# EAGLE design PowerBoard (EAGLE 6.5.0)
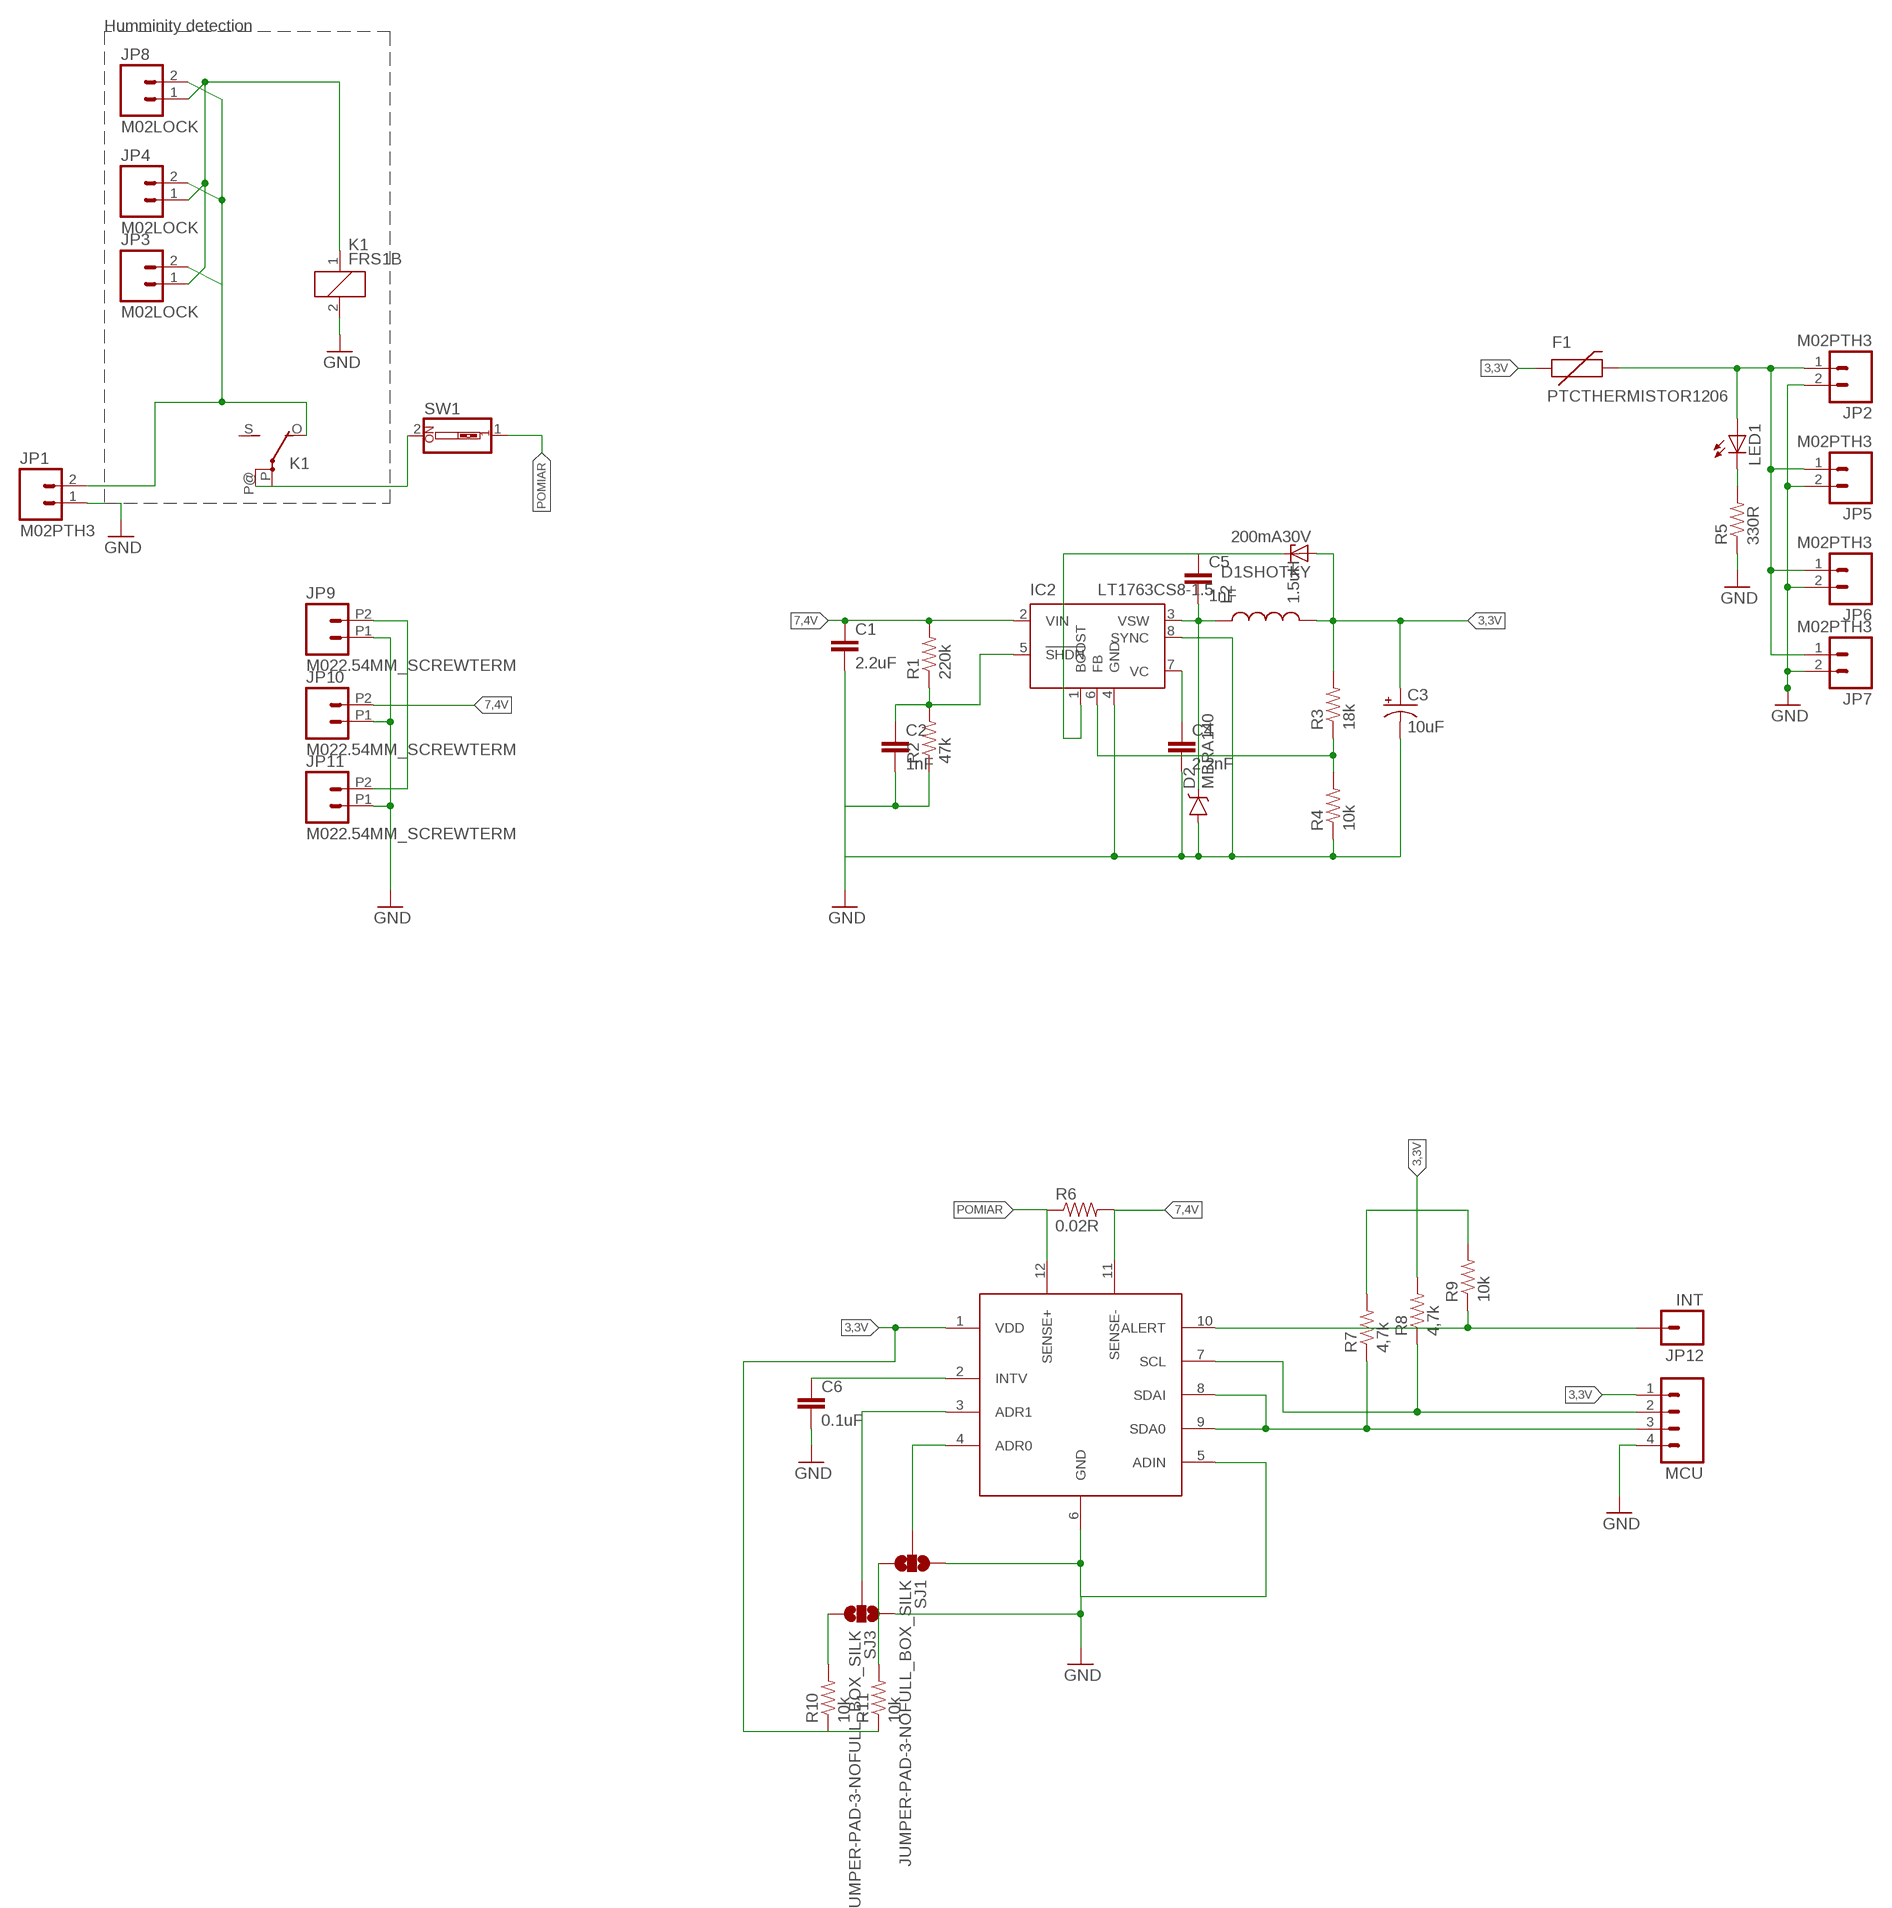
[diagram p0: schematic, sheet 1]

## Parts
C1  2.2uF  CAP0805  [0805]
C2  1nF  CAP0805  [0805]
C3  10uF  CAP_POLC  [PANASONIC_C]
C4  2.2nF  CAP0805  [0805]
C5  1nF  CAP0805  [0805]
C6  0.1uF  CAP0805  [0805]
D1SHOTKY  200mA30V  ZENER-DIODESOD80C  [SOD80C]
D2  MBRA140  [SMA-DIODE]
F1  PTCTHERMISTOR1206  [PTC-1206]
IC2  LT1763CS8-1.5  [SOIC8]
JP1  M02PTH3  [1X02_LONGPADS]
JP2  M02PTH3  [1X02_LONGPADS]
JP3  M02LOCK  [1X02_LOCK]
JP4  M02LOCK  [1X02_LOCK]
JP5  M02PTH3  [1X02_LONGPADS]
JP6  M02PTH3  [1X02_LONGPADS]
JP7  M02PTH3  [1X02_LONGPADS]
JP8  M02LOCK  [1X02_LOCK]
JP9  M022.54MM_SCREWTERM  [1X02_2.54_SCREWTERM]
JP10  M022.54MM_SCREWTERM  [1X02_2.54_SCREWTERM]
JP11  M022.54MM_SCREWTERM  [1X02_2.54_SCREWTERM]
JP12  INT  M01PTH_LONGPAD  [1X01_LONGPAD]
K1  FRS1B  [FRS1B]
L2  1.5uH  INDUCTOR-B82462G  [B82462G]
LED1  LEDSML0805  [SML0805]
MCU  M04POLAR_LOCK  [MOLEX-1X4_LOCK]
R1  220k  RESISTOR0805-RES  [0805]
R2  47k  RESISTOR0805-RES  [0805]
R3  18k  RESISTOR0805-RES  [0805]
R4  10k  RESISTOR0805-RES  [0805]
R5  330R  RESISTOR0805-RES  [0805]
R6  0.02R  RESISTOR2512  [R2512]
R7  4,7k  RESISTOR0805-RES  [0805]
R8  4,7k  RESISTOR0805-RES  [0805]
R9  10k  RESISTOR0805-RES  [0805]
R10  10k  RESISTOR0805-RES  [0805]
R11  10k  RESISTOR0805-RES  [0805]
SJ1  JUMPER-PAD-3-NOFULL_BOX_SILK  [PAD-JUMPER-3-NO_YES_SILK_FULL_BOX]
SJ3  JUMPER-PAD-3-NOFULL_BOX_SILK  [PAD-JUMPER-3-NO_YES_SILK_FULL_BOX]
SW1  SW_DIP-1  [EDG-01]
U$1  LTC2945  [SOP65P490X110-12N]

## Nets
3,3V: C3.+ D1SHOTKY.A F1.1 L2.P$2 MCU.1 R3.2 R7.2 R8.2 R9.2 R10.1 R11.1 U$1.1(VDD)
7,4V: C1.1 IC2.2(VIN) JP9.P2 JP10.P2 JP11.P2 R1.2 R6.2 U$1.11(SENSE-)
AFERFUSE: F1.2 JP2.1 JP5.1 JP6.1 JP7.1 LED1.A
COIL: JP3.1 JP4.1 JP8.1 K1.1
COUT: C5.2 D2.C IC2.3(VSW) L2.P$1
GND: C1.2 C2.2 C3.- C4.2 C6.2 D2.A IC2.4(GND) IC2.8(SYNC) JP1.1 JP2.2 JP5.2 JP6.2 JP7.2 JP9.P1 JP10.P1 JP11.P1 K1.2 MCU.4 R2.1 R4.1 R5.1 SJ1.1 SJ3.1 U$1.5(ADIN) U$1.6(GND)
N$1: C2.1 IC2.5(!SHDN) R1.1 R2.2
N$3: IC2.6(FB) R3.1 R4.2
N$4: C4.1 IC2.7(VC)
N$5: C5.1 D1SHOTKY.C IC2.1(BOOST)
N$7: LED1.C R5.2
N$9: JP12.1 R9.1 U$1.10(ALERT)
N$10: MCU.2 R8.1 U$1.7(SCL)
N$11: MCU.3 R7.1 U$1.8(SDAI) U$1.9(SDA0)
N$12: C6.1 U$1.2(INTV)
N$13: SJ3.2 U$1.3(ADR1)
N$14: SJ1.2 U$1.4(ADR0)
N$15: R10.2 SJ3.3
N$16: R11.2 SJ1.3
POMIAR: R6.1 SW1.1 U$1.12(SENSE+)
PRERELAY: JP1.2 JP3.2 JP4.2 JP8.2 K1.O(2:O)
PRESWITCH: K1.P(2:P) K1.P@(2:P) SW1.2
Unconnected: K1.S(2:S)

## Notes on the sheet
- Humminity detection

## Library data of the parts
C1 C2 C4-C6 = SparkFun-Capacitors:CAP: Capacitor Standard 0603 ceramic capacitor, and 0.1" leaded capacitor.
C3 = SparkFun-Passives:CAP_POL: Capacitor Polarized These are standard SMD and PTH capacitors. Normally 10uF, 47uF, and 100uF in electrolytic and tantalum varieties. Always verify the external diameter of the through hole cap, it varies with capacity, voltage, and manufacturer. The EIA devices should be standard.
D1SHOTKY = diode:ZENER-DIODE: Z-Diode
D2 = SparkFun-DiscreteSemi:MBRA140: 40V, 1A Schottky rectifier SMA/DO-214AC package DIO-08053; PROD_ID: DIO-08053
F1 = SparkFun-PowerIC:PTC: Resettable Fuse PTC Resettable Fuse. Spark Fun Electronics SKU : COM-08357; PROD_ID: RES-08585
IC2 = linear-technology:LT1763CS8: 500mA, Low Noise, LDO Micropower Regulators Source: http://cds.linear.com/docs/Datasheet/1763ff.pdf; MPN: LT1763CS8-1.5; OC_FARNELL: 1501016; OC_NEWARK: 57M6043
JP1-JP11 = SparkFun-Connectors:M02: Standard 2-pin 0.1" header. Use with - straight break away headers ( PRT-00116) - right angle break away headers (PRT-00553) - swiss pins (PRT-00743) - machine pins (PRT-00117) - female headers (PRT-00115) Molex polarized connector foot print use with: PRT-08233 with associated crimp pins and housings. 2.54_SCREWTERM for use with PRT-10571. 3.5mm Screw Terminal footprints for PRT-08084 5mm Screw Terminal footprints for use with PRT-08432
JP12 = SparkFun-Connectors:M01: Header 1 Standard 1-pin 0.1" header. Use with straight break away headers (SKU : PRT-00116), right angle break away headers (PRT-00553), swiss pins (PRT-00743), machine pins (PRT-00117), and female headers (PRT-00115).
K1 = relay:FRS1B: RELAY 1 x switch, same as V23101-D6-A201, Siemens; OC_FARNELL: unknown; OC_NEWARK: unknown
L2 = SparkFun-Passives:INDUCTOR: Inductors Basic Inductor/Choke - 0603 and 1206. Footprints are not proven and vary greatly between part numbers. SRN6045- 33uH, 20% 1.4A SDR0403-560KL - 56uH, 10%, 500mA RMS/740mA peak
LED1 = led:LED: LED OSRAM: - CHIPLED LG R971, LG N971, LY N971, LG Q971, LY Q971, LO R971, LY R971 LH N974, LH R974 LS Q976, LO Q976, LY Q976 LO Q996 - Hyper CHIPLED LW Q18S LB Q993, LB Q99A, LB R99A - SideLED LS A670, LO A670, LY A670, LG A670, LP A670 LB A673, LV A673, LT A673, LW A673 LH A674 LY A675 LS A676, LA A676, LO A676, LY A676, LW A676 LS A679, LY A679, LG A679 - Hyper Micro SIDELED® LS Y876, LA Y876, LO Y876, LY Y876 LT Y87S - SmartLED LW L88C, LW L88S LB L89C, LB L89S, LG L890 LS L89K, LO L89K, LY L89K LS L896, LA L896, LO L896, LY L896 - TOPLED LS T670, LO T670, LY T670, LG T670, LP T670 LSG T670, LSP T670, LSY T670, LOP T670, LYG T670 LG T671, LOG T671, LSG T671 LB T673, LV T673, LT T673, LW T673 LH T674 LS T676, LA T676, LO T676, LY T676, LB T676, LH T676, LSB T676, LW T676 LB T67C, LV T67C, LT T67C, LS T67K, LO T67K, LY T67K, LW E67C LS E67B, LA E67B, LO E67B, LY E67B, LB E67C, LV E67C, LT E67C LW T67C LS T679, LY T679, LG T679 LS T770, LO T770, LY T770, LG T770, LP T770 LB T773, LV T773, LT T773, LW T773 LH T774 LS E675, LA E675, LY E675, LS T675 LS T776, LA T776, LO T776, LY T776, LB T776 LHGB T686 LT T68C, LB T68C - Hyper Mini TOPLED® LB M676 - Mini TOPLED Santana® LG M470 LS M47K, LO M47K, LY M47K Source: http://www.osram.convergy.de LUXEON: - LUMILED® LXK2-PW12-R00, LXK2-PW12-S00, LXK2-PW14-U00, LXK2-PW14-V00 LXK2-PM12-R00, LXK2-PM12-S00, LXK2-PM14-U00 LXK2-PE12-Q00, LXK2-PE12-R00, LXK2-PE12-S00, LXK2-PE14-T00, LXK2-PE14-U00 LXK2-PB12-K00, LXK2-PB12-L00, LXK2-PB12-M00, LXK2-PB14-N00, LXK2-PB14-P00, LXK2-PB14-Q00 LXK2-PR12-L00, LXK2-PR12-M00, LXK2-PR14-Q00, LXK2-PR14-R00 LXK2-PD12-Q00, LXK2-PD12-R00, LXK2-PD12-S00 LXK2-PH12-R00, LXK2-PH12-S00 LXK2-PL12-P00, LXK2-PL12-Q00, LXK2-PL12-R00 Source: www.luxeon.com KINGBRIGHT: KA-3528ASYC Source: www.kingbright.com
MCU = SparkFun-Connectors:M04: Header 4 Standard 4-pin 0.1" header. Use with straight break away headers (SKU : PRT-00116), right angle break away headers (PRT-00553), swiss pins (PRT-00743), machine pins (PRT-00117), and female headers (PRT-00115). Molex polarized connector foot print use with SKU : PRT-08231 with associated crimp pins and housings. 1MM SMD Version SKU: PRT-10208
R1-R5 R7-R11 = SparkFun-Resistors:RESISTOR: Resistor Basic schematic elements and footprints for 0603, 1206, and PTH resistors.
R6 = SparkFun-Passives:RESISTOR: Resistor Basic schematic elements and footprints for 0603, 1206, and PTH resistors.
SJ1 SJ3 = SparkFun-Passives:JUMPER-PAD-3-NO
SW1 = special:SW_DIP-1: DIP SWITCH
U$1 = LTC_By_element14_Batch_1:LTC2945

## Board
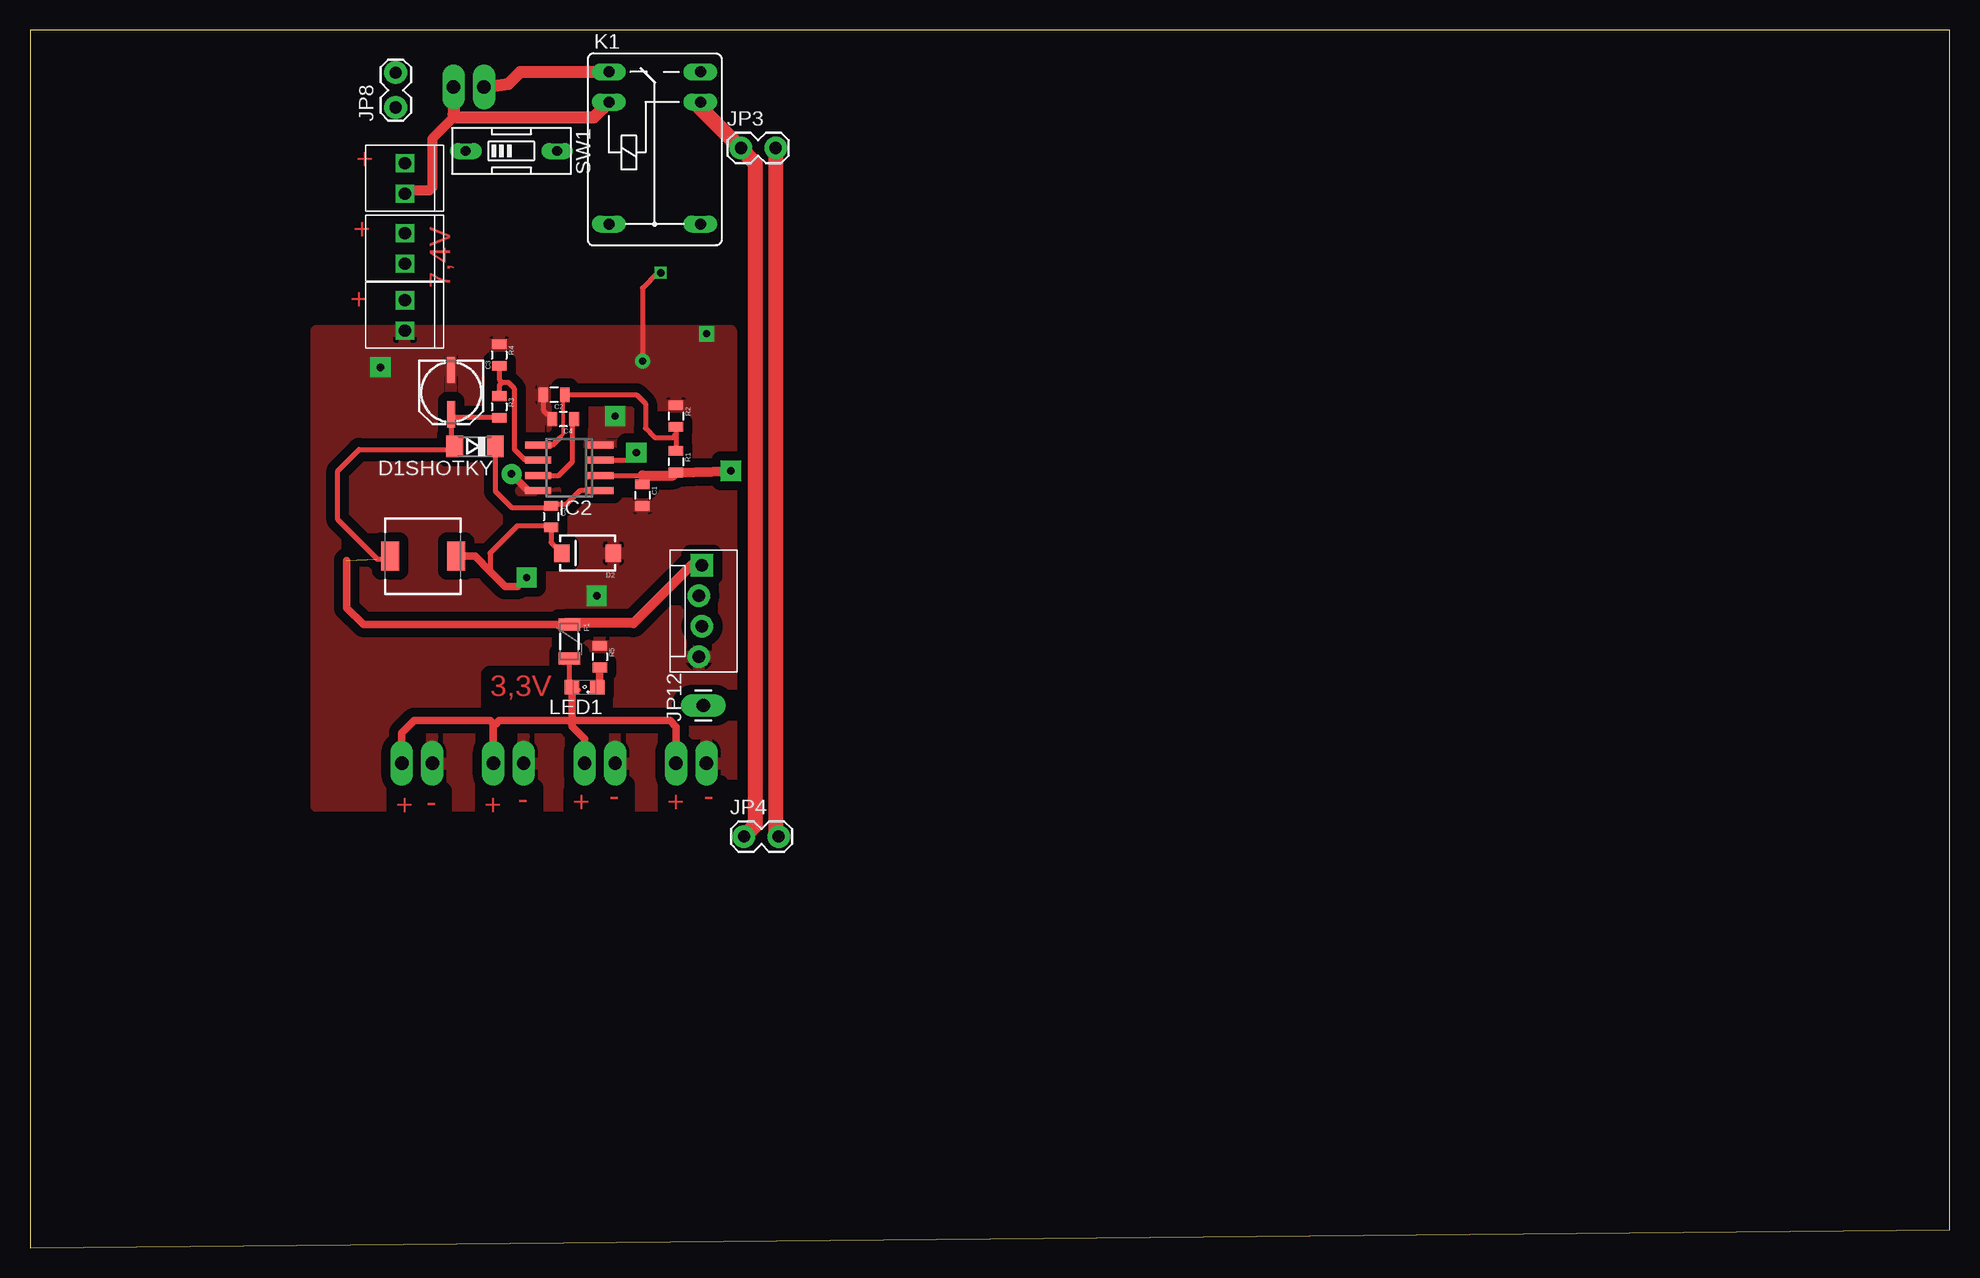
[diagram p1: board, top side]
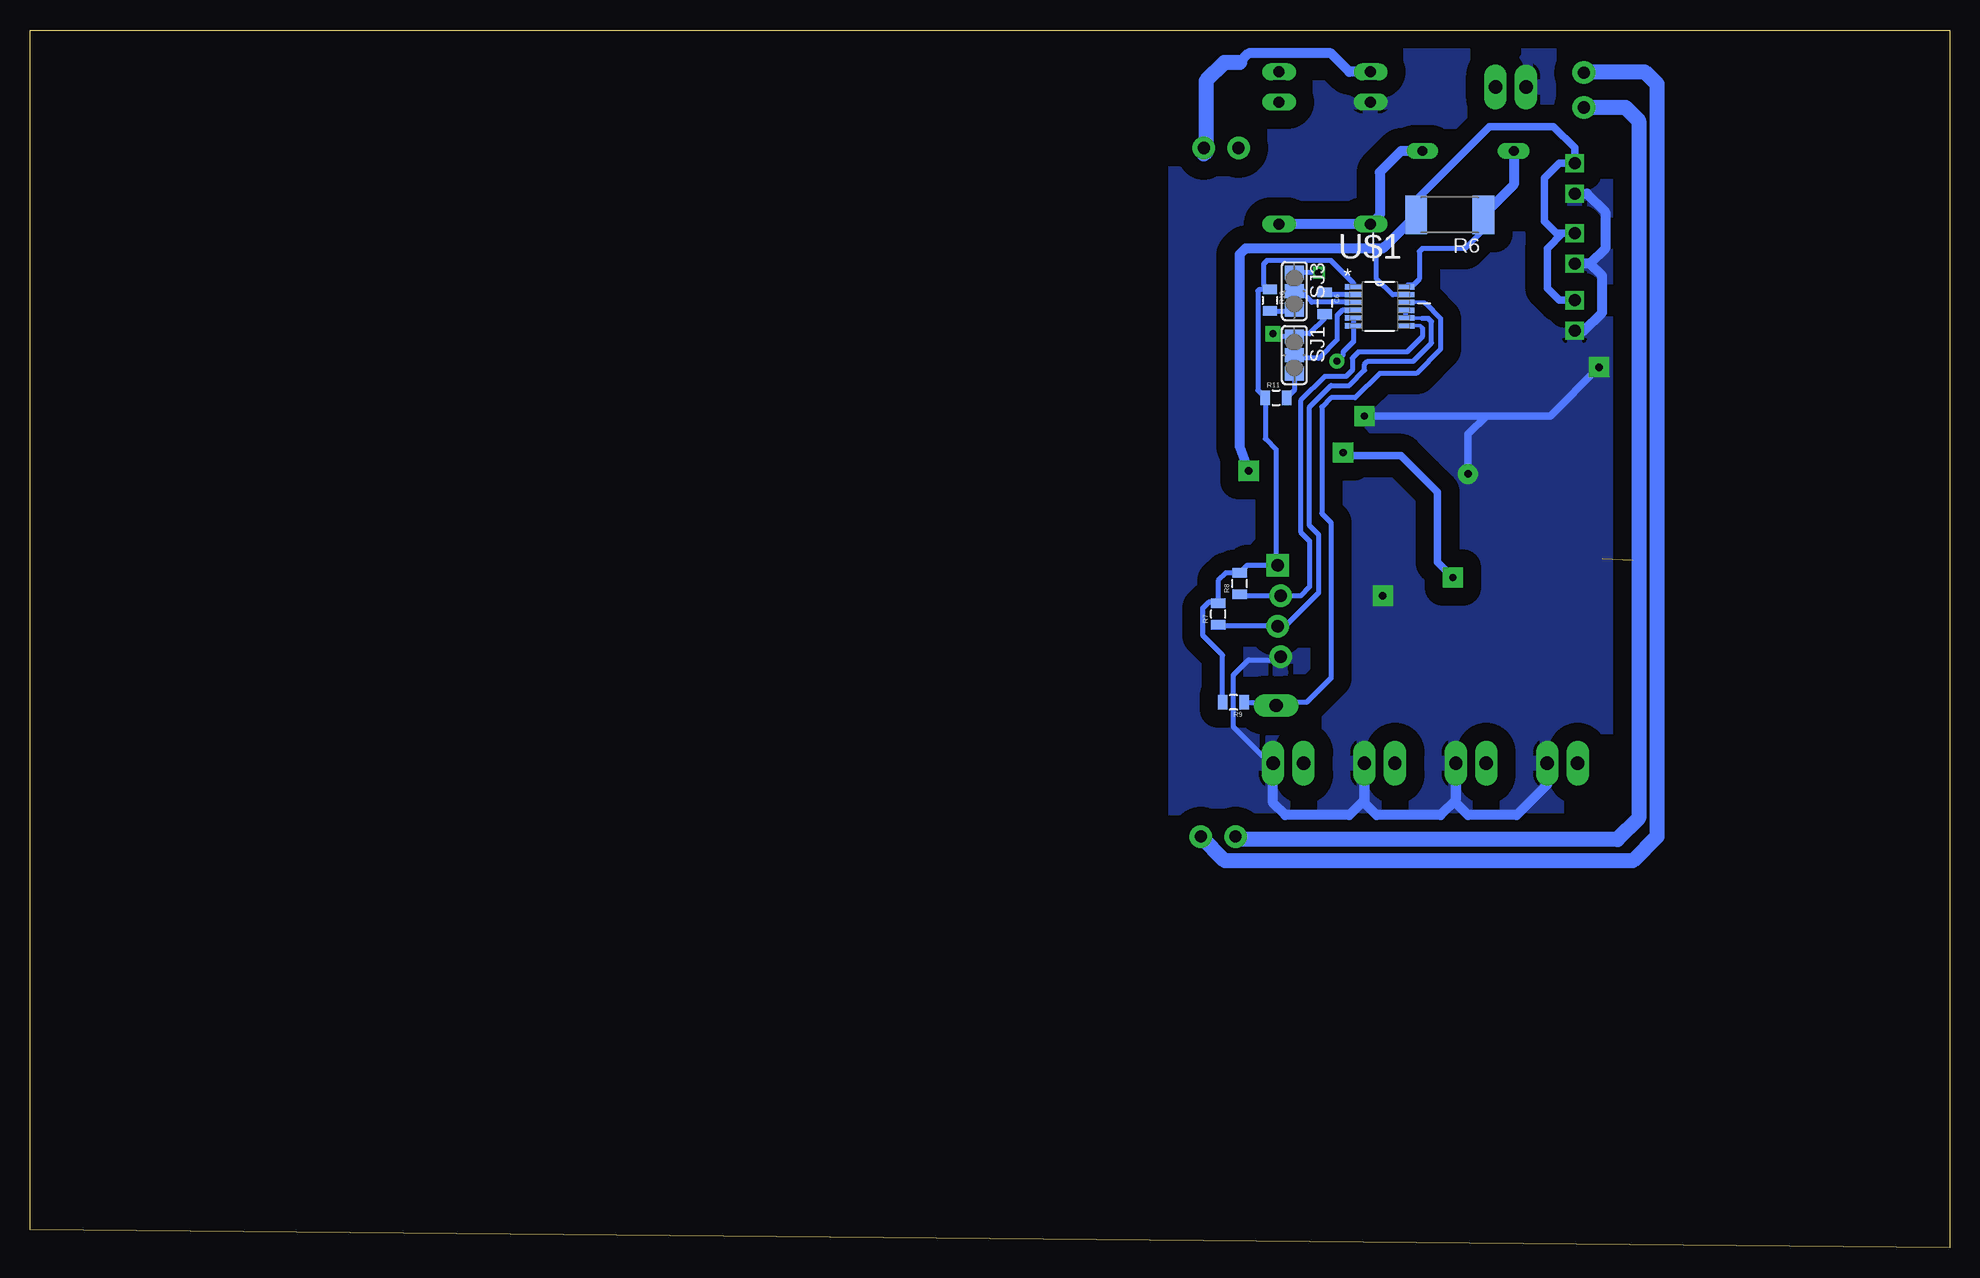
[diagram p2: board, bottom side, seen from below]

Size 160 x 101.52 mm. Coordinates in mm from the lower left corner, seen from the top.
Outline: 0,0 160,1.52 160,101.52 0,101.52 0,0
Copper layers (1*16): Top 0.035mm / dielectric 1.5mm / Bottom 0.035mm
Design rules "default": minimum track width 10mil, minimum drill 24mil, track to track 8mil, track to pad 8mil, pad to pad 8mil, via to via 8mil, smd to smd 8mil, copper to edge 40mil, drill to drill 8mil, minimum pad ring 10mil, minimum via ring 8mil, stop-mask expansion 4mil, vias tented up to drill 0mil, thermal gap 10mil

### Footprints (pad centres in the part's own frame; a part is rotated, then mirrored left to right if it is on the bottom)
0805 = smd 0.8 x 1.2: 1 -0.9,0; 2 0.9,0
PANASONIC_C = smd 2.2 x 0.65: + 1.9,-0.2; - -1.8,-0.2
SOD80C = smd 1.4 x 1.8: A 1.7,0; C -1.7,0
SMA-DIODE = smd 1.27 x 1.47: A -2.15,0; C 2.15,0
PTC-1206 = smd 1 x 1.8: 1 -1.4,0; 2 1.4,0
SOIC8 = smd 0.6 x 2.2: 1 -1.905,-2.6; 2 -0.635,-2.6; 3 0.635,-2.6; 4 1.905,-2.6; 5 1.905,2.6; 6 0.635,2.6; 7 -0.635,2.6; 8 -1.905,2.6
1X02_LONGPADS = drill 1.118 pad 1.88 long: 1 0,0; 2 2.54,0
1X02_LOCK = drill 1.016 pad 1.88: 1 -0.178,0; 2 2.718,0
1X02_2.54_SCREWTERM = drill 1.016 square: P1 2.54,0; P2 0,0
1X01_LONGPAD = drill 1.118 pad 1.88 long: 1 0,0
FRS1B = drill 0.914 long: 1 0,3.81; 2 0,-3.81; O -2.54,-3.81; P 10.16,3.81; P@ 10.16,-3.81; S -2.54,3.81
B82462G = smd 2.4 x 1.5: P$1 0,2.75; P$2 0,-2.75
SML0805 = smd 1.2 x 1.2: A 1.05,0; C -1.05,0
MOLEX-1X4_LOCK = drill 1.016 pad 1.88 square: 1 0,0.127 | drill 1.016 pad 1.88: 2 2.54,-0.127; 3 5.08,0.127; 4 7.62,-0.127
R2512 = smd 1.8 x 3.2: 1 -2.8,0; 2 2.8,0
PAD-JUMPER-3-NO_YES_SILK_FULL_BOX = smd 1.168 x 1.6: 1 -1.524,0; 2 0,0; 3 1.524,0
EDG-01 = drill 0.813 long: 1 0,-3.81; 2 0,3.81
SOP65P490X110-12N = smd 1.397 x 0.432: 1 -2.184,1.626; 2 -2.184,0.965; 3 -2.184,0.33; 4 -2.184,-0.33; 5 -2.184,-0.965; 6 -2.184,-1.626; 7 2.184,-1.626; 8 2.184,-0.965; 9 2.184,-0.33; 10 2.184,0.33; 11 2.184,0.965; 12 2.184,1.626

### Placement (x,y rotation side)
C1  51.05,62.74 270 top
C2  43.69,71.12 180 top
C3  35.31,71.37 270 top
C4  44.45,69.09 180 top
C5  43.43,60.96 270 top
C6  52.07,78.74 270 bottom
D1SHOTKY  37.08,66.8 180 top
D2  46.48,57.91 180 top
F1  44.96,50.55 270 top
IC2  44.96,65.02 90 top
JP1  35.31,96.77 0 top
JP2  46.23,40.39 0 top
JP3  59.44,91.69 0 top
JP4  59.69,34.29 0 top
JP5  53.85,40.39 0 top
JP6  38.61,40.39 0 top
JP7  30.99,40.39 0 top
JP8  30.48,95.25 90 top
JP9  31.24,84.58 270 top
JP10  31.24,90.42 270 top
JP11  31.24,78.99 270 top
JP12  56.13,45.21 90 top
K1  52.07,95.5 270 top
L2  32.77,57.66 270 top
LED1  46.23,46.74 180 top
MCU  55.88,56.9 270 top
R1  53.85,65.53 270 top
R2  53.85,69.34 270 top
R3  39.12,70.1 270 top
R4  39.12,74.42 270 top
R5  47.5,49.28 270 top
R6  41.66,86.11 180 bottom
R7  60.96,52.83 90 bottom
R8  59.18,55.37 90 bottom
R9  59.69,45.47 180 bottom
R10  56.64,78.99 270 bottom
R11  56.13,70.87 0 bottom
SJ1  54.61,74.42 270 bottom
SJ3  54.61,79.76 270 bottom
SW1  40.13,91.44 270 top
U$1  47.5,78.49 0 bottom

### Tracks (layer width: path | path; a pad name or v marks a point on that pad's centre or on a via)
3,3V  (1 unrouted)
  Top 0.406: R3.2 35.38,69.2 C3.+ 35.11,67.08 D1SHOTKY.A 35.13,66.55 27.43,66.55 25.65,64.77 25.65,60.71 28.96,57.4 30.27,57.4 | 30.48,57.4 30.27,57.4 | 30.27,57.4 L2.P$2
  Top 0.61: F1.1 44.45,51.95 27.81,51.95 26.42,53.34 26.42,57.3
  Top 0.813: MCU.1 55.12,56.9 50.29,52.07 44.57,52.07 44.45,51.95
  Bottom 0.406: MCU.1 58.56,56.9 R8.2 60.31,56.27 60.96,55.63 R7.2 61.08,53.85 61.72,53.85 62.23,53.34 62.23,51.05 60.59,49.41 R9.2 | MCU.1 57.91,56.9 | U$1.1 49.68,80.42 51.56,82.3 56.9,82.3 57.15,82.04 57.15,80.26 56.78,79.89 R10.1 57.52,79.89 57.66,79.76 57.66,71.49 R11.1 57.03,67.45 56.13,66.55 56.13,57.02 MCU.1
7,4V  (via drill 0.6 pad 1.68)
  Top 0.406: IC2.2 51.04,64.39 51.04,63.65 C1.1
  Top 0.813: v58.42,64.77 R1.2 53.6,64.39 51.04,64.39
  Bottom 0.406: U$1.11 46.43,79.45 47.75,80.77 47.75,82.8 47.12,83.44
  Bottom 0.61: R6.2 44.46,87.37 38.35,93.47 33.02,93.47 31.24,91.69 JP10.P2 32.51,90.42 33.78,89.15 33.78,85.6 32.77,84.58 32.26,84.58 | 32.26,84.58 JP9.P2 | JP11.P2 32.51,78.99 33.53,80.01 33.53,83.31 32.26,84.58
  Bottom 0.813: R6.2 47.12,83.44 47.24,83.31 58.67,83.31 59.18,82.8 59.18,66.8 v58.42,64.77
AFERFUSE
  Top 0.406: F1.2 44.96,47.24 45.21,46.99 45.72,46.48
  Top 0.61: 45.18,43.69 LED1.A 45.18,46.96 45.21,46.99 | 45.18,43.69 45.18,43.47 46.23,42.42 JP2.1 | JP7.1 30.99,42.93 32,43.94 38.35,43.94 38.61,43.69 | 38.35,39.88 38.61,40.13 JP6.1 38.61,43.69 | 38.61,43.69 38.86,43.69 39.12,43.94 44.92,43.94 | 44.92,43.94 45.18,43.69 | JP5.1 53.85,43.43 53.34,43.94 44.92,43.94
COIL
  Top 1.27: JP3.1 59.26,91.62 | 59.26,91.62 59.82,91.06 60.45,90.42 60.45,35.23 JP4.1 | K1.1 55.88,95 59.26,91.62
  Bottom 1.27: JP8.1 27,95.07 25.91,93.98 25.91,35.81 27.69,34.04 59.26,34.04 JP4.1
COUT  (via drill 0.6 pad 1.68)  (1 unrouted)
  Top 0.406: D2.C 43.43,58.81 C5.2 43.3,60.2 40.64,60.2 38.35,57.91 38.35,56.39 | IC2.3 49.91,65.66 50.55,66.29 | 40.64,55.12 v41.4,55.88
  Top 0.61: 40.64,55.12 39.62,55.12 38.35,56.39 37.08,57.66 L2.P$1
  Bottom 0.406: 50.29,66.04 50.55,66.29
  Bottom 0.61: 50.29,66.04 45.72,66.04 42.67,62.99 42.67,57.15 v41.4,55.88
GND  (via drill 0.6, 0.6 pad 1.27, 0.6 pad 1.68)
  Top 0.406: C2.2 42.79,69.85 C4.2 | v52.58,81.28 52.32,81.28 51.05,80.01 v51.05,73.91
  Top 0.61: IC2.8 41.53,63.12 v40.13,64.52
  Top 0.813: 35.56,94.23 35.31,94.23 33.53,92.46 33.53,88.39 33.27,88.14 31.5,88.14 JP10.P1
  Top 1.016: JP1.1 35.31,94.49 35.56,94.23 46.99,94.23 K1.2
  Bottom 0.406: JP5.2 56.64,40.39 59.69,43.43 59.69,47.75 58.42,49.02 56.01,49.02 MCU.4 | U$1.6 U$1.5 49.68,75.54 50.55,74.68 50.55,74.42 v51.05,73.91 | C6.2 52.07,77.47 53.34,76.2 54.36,76.2 SJ1.1 56.13,75.95 v56.39,76.2 | v52.58,81.28 SJ3.1
  Bottom 0.61: v48.77,69.34 38.61,69.34 | 38.61,69.34 33.27,69.34 v29.21,73.41 | v40.13,64.52 40.13,67.82 38.61,69.34
  Bottom 0.813: JP10.P1 30.23,87.88 28.7,86.36 28.7,83.31 29.97,82.04 | 29.97,82.04 JP9.P1 | JP11.P1 30.48,76.45 28.96,77.98 28.96,81.03 29.97,82.04 | JP7.2 33.53,38.61 36.07,36.07 40.13,36.07 41.15,37.08 JP6.2 41.15,37.34 42.42,36.07 47.75,36.07 48.77,37.08 JP2.2 48.77,37.34 50.04,36.07 55.37,36.07 56.39,37.08 JP5.2
  other vias: 47.24,54.36
  pour Top (isolate 0.762): 23.88,76.45 58.42,76.45 58.42,36.83 23.88,36.83
  pour Bottom (isolate 1.524): 64.01,32 23.88,32 23.88,100.08 64.52,100.08 64.52,32
N$1
  Top 0.305: 44.2,67.56 44.45,67.82 44.45,70.98 C2.1
  Top 0.406: IC2.5 43.56,66.93 44.2,67.56 | R2.2 53.85,67.82 | 53.85,67.82 R1.1 | C2.1 50.55,71.12 51.31,70.36 51.31,68.33 52.07,67.56 53.59,67.56 53.85,67.82
N$3
  Top 0.406: IC2.6 41.27,65.66 40.39,66.55 40.39,71.63 39.88,72.14 39.37,72.14 | 39.37,72.14 39.12,71.88 R3.1 | R4.2 39.12,72.39 39.37,72.14
N$4
  Top 0.406: IC2.7 44.07,64.39 45.21,65.53 45.21,68.95 C4.1
N$5
  Top 0.406: IC2.1 45.85,63.12 44.7,61.98 43.55,61.98 C5.1 43.3,61.72 40.13,61.72 38.78,63.07 D1SHOTKY.C
N$6  (via drill 0.6 pad 1.68)
  other vias: 50.55,66.29
N$7
  Top 0.61: R5.2 47.5,46.96 LED1.C
N$9
  Bottom 0.305: U$1.10 43.76,78.82 43.69,78.74
  Bottom 0.406: 43.69,78.74 42.42,77.47 42.42,74.93 44.45,72.9 47.5,72.9 49.53,70.87 51.56,70.87 52.32,70.1 52.32,61.21 51.56,60.45 51.56,47.5 53.59,45.47 55.88,45.47 JP12.1 56.39,45.47 R9.1
N$10
  Bottom 0.305: U$1.7 44.09,76.86 43.94,76.71
  Bottom 0.406: R8.1 59.07,54.36 MCU.2 54.1,54.36 53.34,55.12 53.34,58.93 54.1,59.69 54.1,70.61 52.07,72.64 50.29,72.64 49.78,73.15 49.78,74.17 49.28,74.68 45.21,74.68 43.94,75.95 43.94,76.71
N$11
  Bottom 0.305: U$1.8 43.99,77.52 43.94,77.47
  Bottom 0.406: U$1.8 U$1.9 | R7.1 60.84,51.82 MCU.3 55.37,51.82 52.58,54.61 52.58,59.44 53.34,60.2 53.34,70.1 51.56,71.88 50.04,71.88 48.77,73.15 48.77,73.66 48.51,73.91 44.7,73.91 43.18,75.44 43.18,77.22 43.43,77.47 43.94,77.47
N$12
  Bottom 0.406: U$1.2 51.63,79.45 C6.1
N$13
  Bottom 0.406: U$1.3 53.16,78.82 54.1,79.76 | 53.85,79.76 54.1,79.76 | 54.1,79.76 SJ3.2
N$14
  Bottom 0.406: U$1.4 50.62,78.16 51.05,77.72 51.05,75.69 52.58,74.17 54.36,74.17 SJ1.2
N$15
  Bottom 0.406: R10.2 54.75,78.09 SJ3.3
N$16
  Bottom 0.406: SJ1.3 54.61,71.49 R11.2
POMIAR
  Bottom 0.406: R6.1 38.86,84.84 40.39,83.31 43.94,83.31 44.2,83.06 44.2,80.77 44.7,80.26 45.16,80.26 U$1.12
  Bottom 0.813: 38.6,86.36 R6.1 36.32,88.64 SW1.1
PRERELAY
  Top 1.016: JP1.2 39.88,97.03 40.89,98.04 K1.O
  Top 1.27: JP3.2 62.15,34.54 JP4.2
  Bottom 0.813: 37.59,97.03 JP1.2 | K1.O 50.04,98.04 51.56,99.57 58.42,99.57 59.18,98.81
  Bottom 1.27: JP8.2 30.48,98.04 25.4,98.04 24.38,97.03 24.38,34.29 26.42,32.26 60.38,32.26 JP4.2 | 59.18,98.81 60.45,98.81 61.98,97.28 61.98,91.36 62.15,91.19 JP3.2
PRESWITCH
  Bottom 0.813: SW1.2 45.72,91.44 47.5,89.66 47.5,86.11 K1.P@ K1.P | K1.P 56.13,85.34 56.39,85.09 56.13,85.09 K1.P

### Text on the board
Top: + | + | 7,4V | + | 3,3V | + | - | + | - | + | - | + | -